# EAGLE design IR (EAGLE 7.7.0)
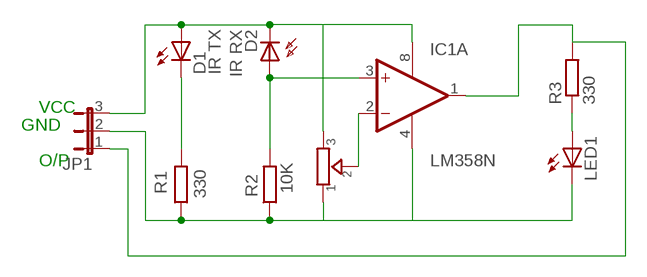
[diagram p0: schematic, sheet 1]

## Parts
D1  IR TX  SFH482  [SFH482]
D2  IR RX  BPW32  [BPW32]
IC1  LM358N  [DIL08]
JP1  JP2E  [JP2]
LED1  LEDLZR181  [LZR181]
R1  330  R0204/7  [0204/7]
R2  10K  R0204/7  [0204/7]
R3  330  R0204/7  [0204/7]
R5  TRIMMER-3306F  [TRIMMER_3306F]

## Nets
N$1: D1.A D2.K(C) IC1.8(P:V+) JP1.3 R5.3
N$2: D1.K(C) R1.2
N$3: IC1.4(P:V-) JP1.2 LED1.K(C) R1.1 R2.1 R5.1
N$4: LED1.A R3.1
N$5: IC1.1(A:OUT) JP1.1 R3.2
N$6: IC1.2(A:-IN) R5.2
N$7: D2.A IC1.3(A:+IN) R2.2
Unconnected: IC1.5(B:+IN) IC1.6(B:-IN) IC1.7(B:OUT)

## Notes on the sheet
- VCC
- GND
- O/P

## Library data of the parts
D1 = led:SFH482: IR LED infrared emitting diode, Infineon
D2 = opto-trans-siemens:BPW32: PHOTO DIODE; OC_FARNELL: unknown; OC_NEWARK: unknown
IC1 = linear:LM358: OP AMP also LM158; LM258; LM2904 Source: http://cache.national.com/ds/LM/LM158.pdf
JP1 = jumper:JP2E: JUMPER
LED1 = led:LED: LED OSRAM: - CHIPLED LG R971, LG N971, LY N971, LG Q971, LY Q971, LO R971, LY R971 LH N974, LH R974 LS Q976, LO Q976, LY Q976 LO Q996 - Hyper CHIPLED LW Q18S LB Q993, LB Q99A, LB R99A - SideLED LS A670, LO A670, LY A670, LG A670, LP A670 LB A673, LV A673, LT A673, LW A673 LH A674 LY A675 LS A676, LA A676, LO A676, LY A676, LW A676 LS A679, LY A679, LG A679 - Hyper Micro SIDELED® LS Y876, LA Y876, LO Y876, LY Y876 LT Y87S - SmartLED LW L88C, LW L88S LB L89C, LB L89S, LG L890 LS L89K, LO L89K, LY L89K LS L896, LA L896, LO L896, LY L896 - TOPLED LS T670, LO T670, LY T670, LG T670, LP T670 LSG T670, LSP T670, LSY T670, LOP T670, LYG T670 LG T671, LOG T671, LSG T671 LB T673, LV T673, LT T673, LW T673 LH T674 LS T676, LA T676, LO T676, LY T676, LB T676, LH T676, LSB T676, LW T676 LB T67C, LV T67C, LT T67C, LS T67K, LO T67K, LY T67K, LW E67C LS E67B, LA E67B, LO E67B, LY E67B, LB E67C, LV E67C, LT E67C LW T67C LS T679, LY T679, LG T679 LS T770, LO T770, LY T770, LG T770, LP T770 LB T773, LV T773, LT T773, LW T773 LH T774 LS E675, LA E675, LY E675, LS T675 LS T776, LA T776, LO T776, LY T776, LB T776 LHGB T686 LT T68C, LB T68C - Hyper Mini TOPLED® LB M676 - Mini TOPLED Santana® LG M470 LS M47K, LO M47K, LY M47K Source: http://www.osram.convergy.de LUXEON: - LUMILED® LXK2-PW12-R00, LXK2-PW12-S00, LXK2-PW14-U00, LXK2-PW14-V00 LXK2-PM12-R00, LXK2-PM12-S00, LXK2-PM14-U00 LXK2-PE12-Q00, LXK2-PE12-R00, LXK2-PE12-S00, LXK2-PE14-T00, LXK2-PE14-U00 LXK2-PB12-K00, LXK2-PB12-L00, LXK2-PB12-M00, LXK2-PB14-N00, LXK2-PB14-P00, LXK2-PB14-Q00 LXK2-PR12-L00, LXK2-PR12-M00, LXK2-PR14-Q00, LXK2-PR14-R00 LXK2-PD12-Q00, LXK2-PD12-R00, LXK2-PD12-S00 LXK2-PH12-R00, LXK2-PH12-S00 LXK2-PL12-P00, LXK2-PL12-Q00, LXK2-PL12-R00 Source: www.luxeon.com KINGBRIGHT: KA-3528ASYC Source: www.kingbright.com
R1-R3 = eagle-ltspice:R: RESISTOR, European symbol; SPICEMODEL: NONE; SPICEPREFIX: R
R5 = dp_devices.v6:TRIMMER: Trimmer resistor

## Board
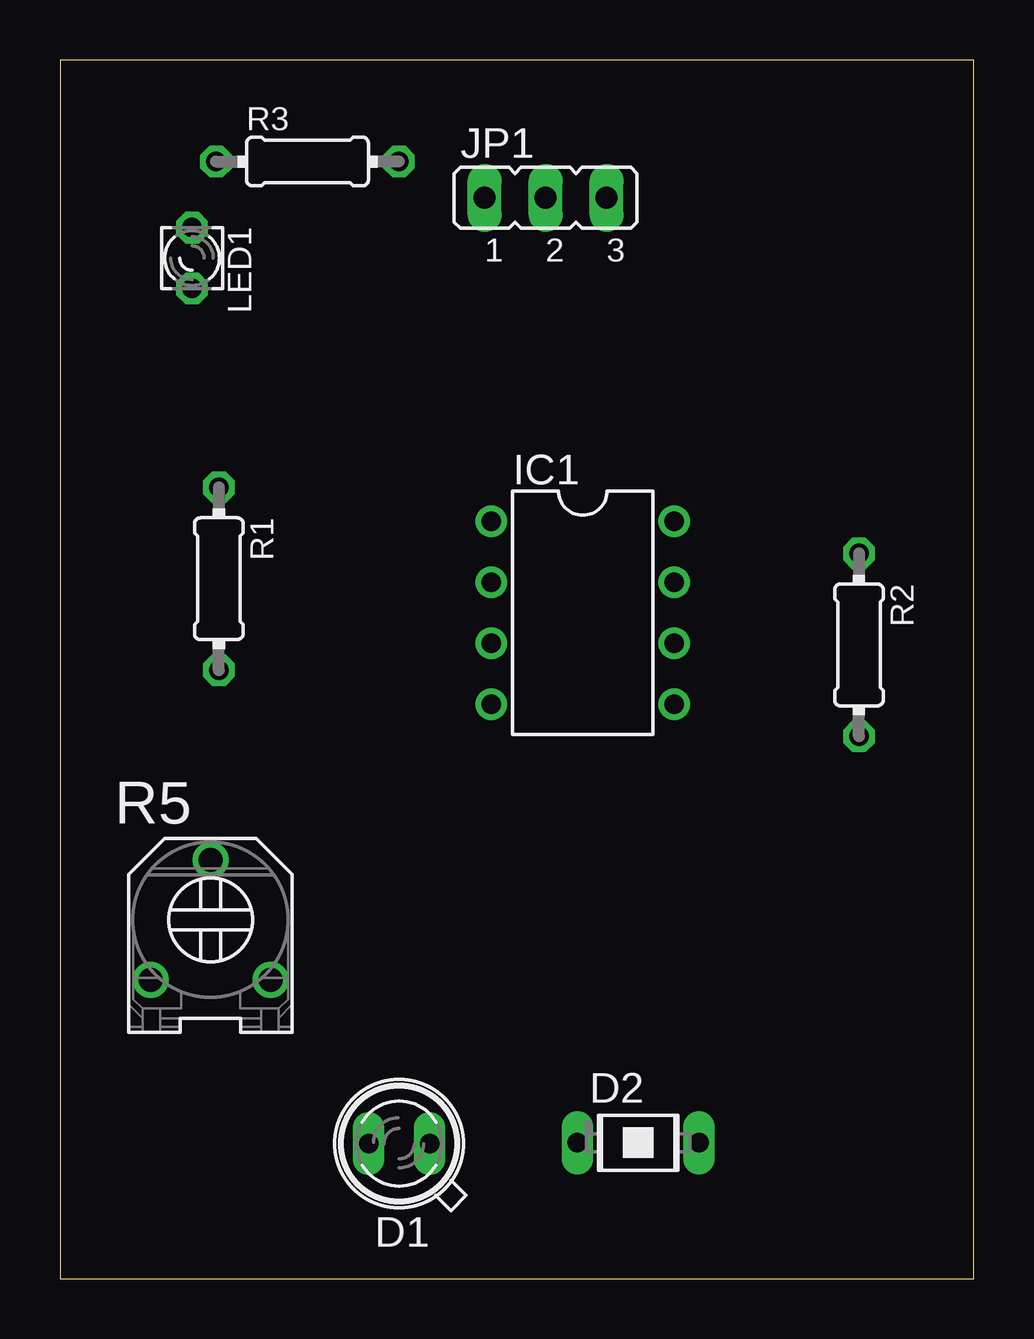
[diagram p1: board, top side]
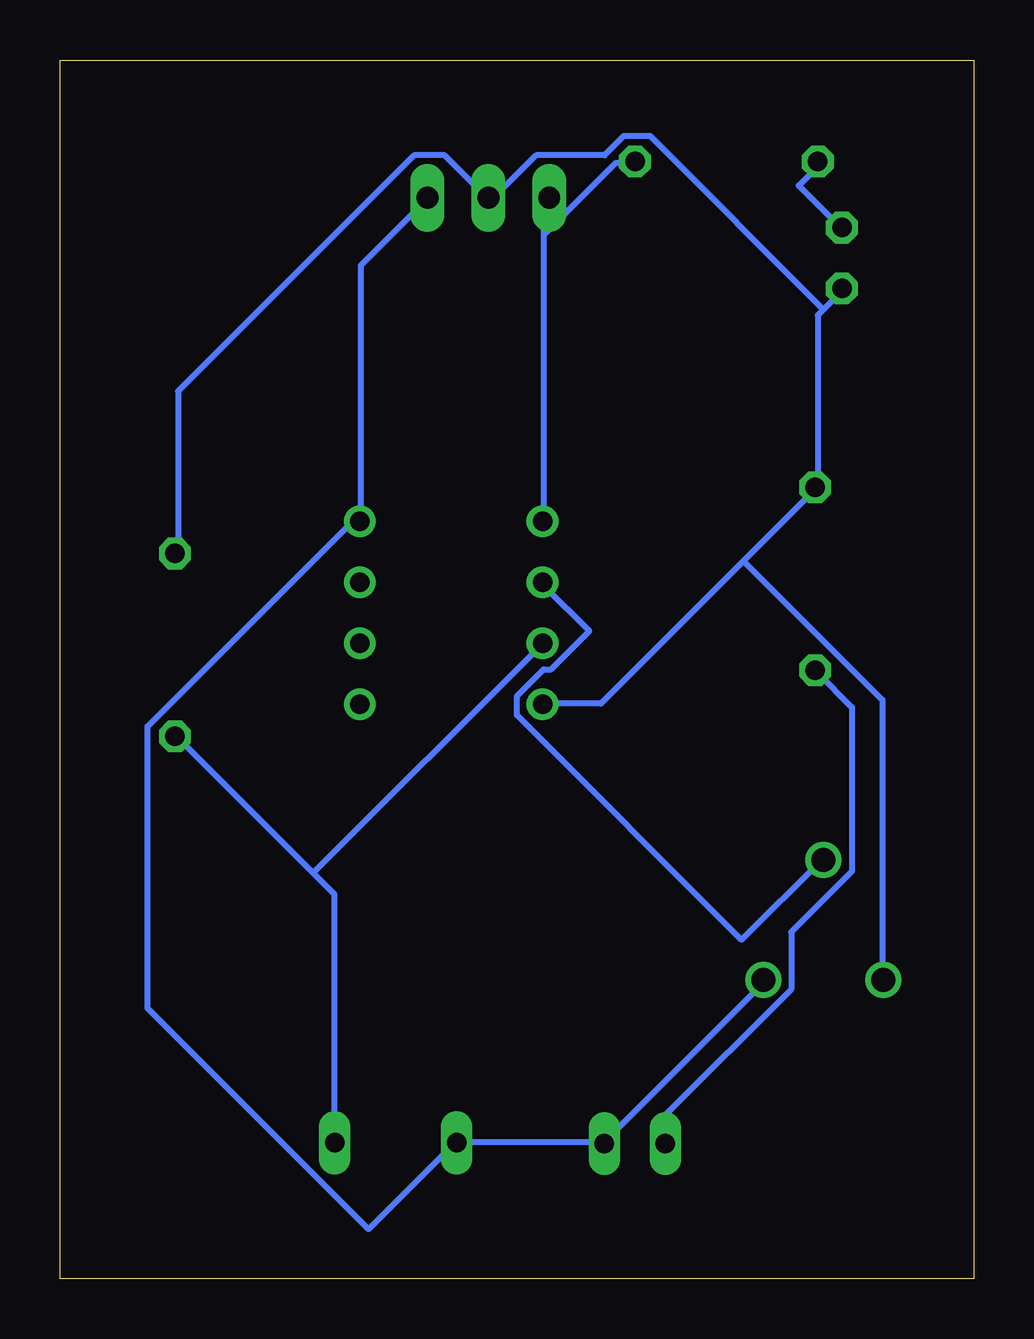
[diagram p2: board, bottom side, seen from below]

Size 38.1 x 50.8 mm. Coordinates in mm from the lower left corner, seen from the top.
Outline: 0,0 38.1,0 38.1,50.8 0,50.8 0,0
Copper layers (1*16): Top 0.035mm / dielectric 1.5mm / Bottom 0.035mm
Design rules "default": minimum track width 10mil, minimum drill 24mil, track to track 8mil, track to pad 8mil, pad to pad 8mil, via to via 8mil, smd to smd 8mil, copper to edge 40mil, drill to drill 8mil, minimum pad ring 10mil, minimum via ring 8mil, stop-mask expansion 4mil, vias tented up to drill 0mil, thermal gap 10mil

### Footprints (pad centres in the part's own frame; a part is rotated, then mirrored left to right if it is on the bottom)
SFH482 = drill 0.813 long: A -1.27,0; K 1.27,0
BPW32 = drill 0.813 long: A 0,2.54; K 0,-2.54
DIL08 = drill 0.813 pad 1.27: 1 -3.81,-3.81; 2 -1.27,-3.81; 3 1.27,-3.81; 4 3.81,-3.81; 5 3.81,3.81; 6 1.27,3.81; 7 -1.27,3.81; 8 -3.81,3.81
JP2 = drill 0.914 long: 1 -2.54,0; 2 0,0; 3 2.54,0
LZR181 = drill 0.813 octagon: A -1.27,0; K 1.27,0
0204/7 = drill 0.813 octagon: 1 -3.81,0; 2 3.81,0
TRIMMER_3306F = drill 1: 1 -2.5,-2.5; 2 0,2.5; 3 2.5,-2.5

### Placement (x,y rotation side)
D1  14.14,5.63 180 top
D2  24.1,5.67 270 top
IC1  21.79,27.76 270 top
JP1  20.24,45.05 0 top
LED1  5.5,42.54 270 top
R1  6.62,29.18 270 top
R2  33.31,26.42 270 top
R3  10.32,46.57 0 top
R5  6.28,14.96 0 top

### Tracks (layer width: path | path; a pad name or v marks a point on that pad's centre or on a via)
N$1
  Bottom 0.254: JP1.3 22.86,44.93 25.56,42.23 25.56,31.59 IC1.8 25.72,31.43 26.04,31.43 34.45,23.02 34.45,11.27 25.24,2.06 21.59,5.71 D2.K 21.43,5.71 15.56,5.71 D1.A 15.4,5.71 8.89,12.22 8.89,12.38 R5.3
N$2
  Bottom 0.254: D1.K 12.86,5.71 12.86,6.83 7.62,12.06 7.62,14.45 5.08,16.99 5.08,23.81 6.51,25.24 R1.2
N$3
  Bottom 0.254: R2.1 33.18,30.32 33.18,36.99 23.34,46.83 22.07,46.83 20.32,45.09 JP1.2 20.16,45.09 20,45.09 18.26,46.83 15.4,46.83 14.61,47.62 13.49,47.62 6.27,40.4 | 6.27,40.4 5.56,41.12 LED1.K | 6.27,40.4 6.51,40.16 6.51,33.02 R1.1 6.67,32.86 9.6,29.92 | 9.6,29.92 15.56,23.97 17.94,23.97 IC1.4 | 9.6,29.92 3.81,24.13 3.81,12.54 R5.1
N$4
  Bottom 0.254: LED1.A 5.56,43.81 7.3,45.56 6.35,46.51 R3.1
N$5
  Bottom 0.254: 17.94,43.5 17.94,44.77 17.78,44.93 JP1.1 | 17.94,43.5 17.94,31.59 IC1.1 | 17.94,43.5 14.92,46.51 14.13,46.51 R3.2
N$6
  Bottom 0.254: IC1.2 17.94,28.89 16.03,26.99 17.62,25.4 17.94,25.4 19.05,24.29 19.05,23.5 9.68,14.13 6.35,17.46 R5.2
N$7
  Bottom 0.254: 27.54,16.91 33.18,22.54 R2.2 | 27.54,16.91 26.67,16.03 26.67,5.71 D2.A | 27.54,16.91 18.1,26.35 IC1.3